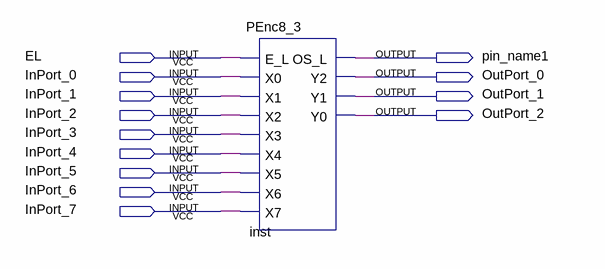
[diagram p0: schematic sheet]
// Quartus schematic EncoderDemo.bdf as structural Verilog: 1 symbols, 13 pins
module EncoderDemo (
  input  EL,
  input  InPort_0,
  input  InPort_1,
  input  InPort_2,
  input  InPort_3,
  input  InPort_4,
  input  InPort_5,
  input  InPort_6,
  input  InPort_7,
  output pin_name1,
  output OutPort_0,
  output OutPort_1,
  output OutPort_2
);

  PEnc8_3 inst (
    .E_L(EL), .X0(InPort_0), .X1(InPort_1), .X2(InPort_2), .X3(InPort_3), .X4(InPort_4), .X5(InPort_5),
    .X6(InPort_6), .X7(InPort_7), .OS_L(pin_name1), .Y2(OutPort_0), .Y1(OutPort_1), .Y0(OutPort_2));
endmodule
